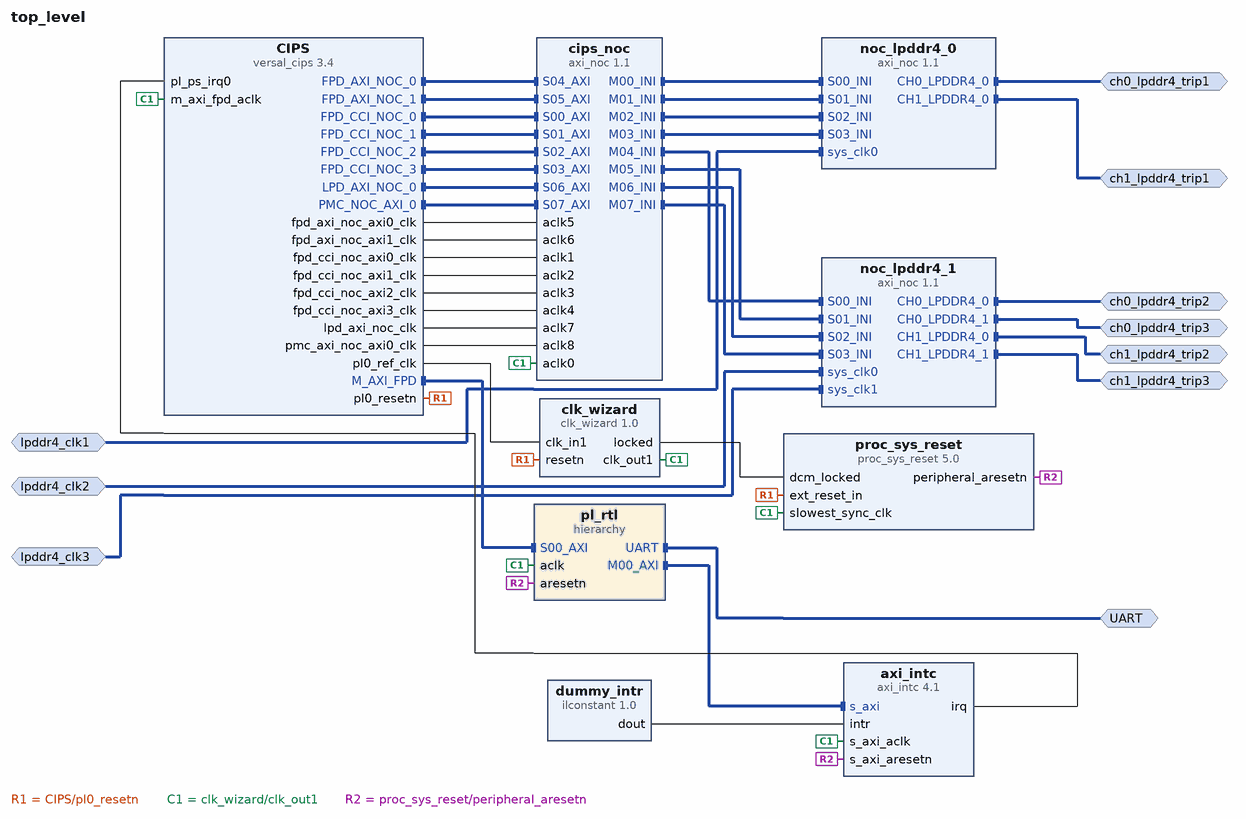
[diagram p0: block diagram of the top level]
# Vivado block design top_level, xcvp1202-vsva2785-2MP-e-S, Vivado 2024.2
create_bd_design top_level

create_bd_intf_port -mode Master -vlnv xilinx.com:interface:lpddr4_rtl:1.0 ch0_lpddr4_trip1
create_bd_intf_port -mode Master -vlnv xilinx.com:interface:lpddr4_rtl:1.0 ch0_lpddr4_trip2
create_bd_intf_port -mode Master -vlnv xilinx.com:interface:lpddr4_rtl:1.0 ch0_lpddr4_trip3
create_bd_intf_port -mode Master -vlnv xilinx.com:interface:lpddr4_rtl:1.0 ch1_lpddr4_trip1
create_bd_intf_port -mode Master -vlnv xilinx.com:interface:lpddr4_rtl:1.0 ch1_lpddr4_trip2
create_bd_intf_port -mode Master -vlnv xilinx.com:interface:lpddr4_rtl:1.0 ch1_lpddr4_trip3
create_bd_intf_port -mode Slave -vlnv xilinx.com:interface:diff_clock_rtl:1.0 lpddr4_clk1
set_property -dict {CONFIG.FREQ_HZ 200321000} [get_bd_intf_ports lpddr4_clk1]
create_bd_intf_port -mode Slave -vlnv xilinx.com:interface:diff_clock_rtl:1.0 lpddr4_clk2
set_property -dict {CONFIG.FREQ_HZ 200321000} [get_bd_intf_ports lpddr4_clk2]
create_bd_intf_port -mode Slave -vlnv xilinx.com:interface:diff_clock_rtl:1.0 lpddr4_clk3
set_property -dict {CONFIG.FREQ_HZ 200321000} [get_bd_intf_ports lpddr4_clk3]
create_bd_intf_port -mode Master -vlnv xilinx.com:interface:uart_rtl:1.0 UART

create_bd_cell -type ip -vlnv xilinx.com:ip:versal_cips:3.4 CIPS
set_property -dict [list \
  CONFIG.CLOCK_MODE Custom \
  CONFIG.DDR_MEMORY_MODE Custom \
  CONFIG.PS_BOARD_INTERFACE ps_pmc_fixed_io \
  CONFIG.PS_PL_CONNECTIVITY_MODE Custom \
  CONFIG.PS_PMC_CONFIG {['CLOCK_MODE Custom', 'DDR_MEMORY_MODE Custom', 'DESIGN_MODE 1', 'DEVICE_INTEGRITY_MODE {Sysmon temperature voltage and external IO monitoring}', 'PMC_CRP_PL0_REF_CTRL_FREQMHZ 99.999992', 'PMC_GPIO0_MIO_PERIPHERAL {{ENABLE 1} {IO {PMC_MIO 0 .. 25}}}', 'PMC_GPIO1_MIO_PERIPHERAL {{ENABLE 1} {IO {PMC_MIO 26 .. 51}}}', 'PMC_MIO37 {{AUX_IO 0} {DIRECTION out} {DRIVE_STRENGTH 8mA} {OUTPUT_DATA high} {PULL pullup} {SCHMITT 0} {SLEW slow} {USAGE GPIO}}', 'PMC_QSPI_FBCLK {{ENABLE 1} {IO {PMC_MIO 6}}}', 'PMC_QSPI_PERIPHERAL_DATA_MODE x4', 'PMC_QSPI_PERIPHERAL_ENABLE 1', 'PMC_QSPI_PERIPHERAL_MODE {Dual Parallel}', 'PMC_REF_CLK_FREQMHZ 33.3333', 'PMC_SD1 {{CD_ENABLE 1} {CD_IO {PMC_MIO 28}} {POW_ENABLE 1} {POW_IO {PMC_MIO 51}} {RESET_ENABLE 0} {RESET_IO {PMC_MIO 12}} {WP_ENABLE 0} {WP_IO {PMC_MIO 1}}}', 'PMC_SD1_PERIPHERAL {{CLK_100_SDR_OTAP_DLY 0x3} {CLK_200_SDR_OTAP_DLY 0x2} {CLK_50_DDR_ITAP_DLY 0x36} {CLK_50_DDR_OTAP_DLY 0x3} {CLK_50_SDR_ITAP_DLY 0x2C} {CLK_50_SDR_OTAP_DLY 0x4} {ENABLE 1} {IO {PMC_MIO 26 .. 36}}}', 'PMC_SD1_SLOT_TYPE {SD 3.0}', 'PMC_USE_PMC_NOC_AXI0 1', 'PS_BOARD_INTERFACE ps_pmc_fixed_io', 'PS_ENET0_MDIO {{ENABLE 1} {IO {PS_MIO 24 .. 25}}}', 'PS_ENET0_PERIPHERAL {{ENABLE 1} {IO {PS_MIO 0 .. 11}}}', 'PS_GEN_IPI0_ENABLE 1', 'PS_GEN_IPI0_MASTER A72', 'PS_GEN_IPI1_ENABLE 1', 'PS_GEN_IPI1_MASTER A72', 'PS_GEN_IPI2_ENABLE 1', 'PS_GEN_IPI2_MASTER A72', 'PS_GEN_IPI3_ENABLE 1', 'PS_GEN_IPI3_MASTER A72', 'PS_GEN_IPI4_ENABLE 1', 'PS_GEN_IPI4_MASTER A72', 'PS_GEN_IPI5_ENABLE 1', 'PS_GEN_IPI5_MASTER A72', 'PS_GEN_IPI6_ENABLE 1', 'PS_GEN_IPI6_MASTER A72', 'PS_I2C0_PERIPHERAL {{ENABLE 1} {IO {PMC_MIO 46 .. 47}}}', 'PS_I2C1_PERIPHERAL {{ENABLE 1} {IO {PMC_MIO 44 .. 45}}}', 'PS_I2CSYSMON_PERIPHERAL {{ENABLE 0} {IO {PMC_MIO 39 .. 40}}}', 'PS_IRQ_USAGE {{CH0 1} {CH1 0} {CH10 0} {CH11 0} {CH12 0} {CH13 0} {CH14 0} {CH15 0} {CH2 0} {CH3 0} {CH4 0} {CH5 0} {CH6 0} {CH7 0} {CH8 0} {CH9 0}}', 'PS_MIO7 {{AUX_IO 0} {DIRECTION in} {DRIVE_STRENGTH 8mA} {OUTPUT_DATA default} {PULL disable} {SCHMITT 0} {SLEW slow} {USAGE Reserved}}', 'PS_MIO9 {{AUX_IO 0} {DIRECTION in} {DRIVE_STRENGTH 8mA} {OUTPUT_DATA default} {PULL disable} {SCHMITT 0} {SLEW slow} {USAGE Reserved}}', 'PS_NUM_FABRIC_RESETS 1', 'PS_PCIE_EP_RESET1_IO {PS_MIO 18}', 'PS_PCIE_EP_RESET2_IO {PS_MIO 19}', 'PS_PCIE_RESET {ENABLE 1}', 'PS_PL_CONNECTIVITY_MODE Custom', 'PS_TTC0_PERIPHERAL_ENABLE 1', 'PS_UART0_PERIPHERAL {{ENABLE 1} {IO {PMC_MIO 42 .. 43}}}', 'PS_USB3_PERIPHERAL {{ENABLE 1} {IO {PMC_MIO 13 .. 25}}}', 'PS_USE_FPD_AXI_NOC0 1', 'PS_USE_FPD_AXI_NOC1 1', 'PS_USE_FPD_CCI_NOC 1', 'PS_USE_M_AXI_FPD 1', 'PS_USE_NOC_LPD_AXI0 1', 'PS_USE_PMCPL_CLK0 1', 'SMON_ALARMS Set_Alarms_On', 'SMON_ENABLE_TEMP_AVERAGING 0', 'SMON_INTERFACE_TO_USE I2C', 'SMON_MEAS36 {{ALARM_ENABLE 1} {ALARM_LOWER 0.00} {ALARM_UPPER 2.00} {AVERAGE_EN 0} {ENABLE 1} {MODE {2 V unipolar}} {NAME VCCAUX} {SUPPLY_NUM 0}}', 'SMON_MEAS37 {{ALARM_ENABLE 1} {ALARM_LOWER 0.00} {ALARM_UPPER 2.00} {AVERAGE_EN 0} {ENABLE 1} {MODE {2 V unipolar}} {NAME VCCAUX_PMC} {SUPPLY_NUM 1}}', 'SMON_MEAS58 {{ALARM_ENABLE 1} {ALARM_LOWER 0.00} {ALARM_UPPER 2.00} {AVERAGE_EN 0} {ENABLE 1} {MODE {2 V unipolar}} {NAME VCC_PMC} {SUPPLY_NUM 2}}', 'SMON_MEAS59 {{ALARM_ENABLE 1} {ALARM_LOWER 0.00} {ALARM_UPPER 2.00} {AVERAGE_EN 0} {ENABLE 1} {MODE {2 V unipolar}} {NAME VCC_PSFP} {SUPPLY_NUM 3}}', 'SMON_MEAS60 {{ALARM_ENABLE 1} {ALARM_LOWER 0.00} {ALARM_UPPER 2.00} {AVERAGE_EN 0} {ENABLE 1} {MODE {2 V unipolar}} {NAME VCC_PSLP} {SUPPLY_NUM 4}}', 'SMON_MEAS62 {{ALARM_ENABLE 1} {ALARM_LOWER 0.00} {ALARM_UPPER 2.00} {AVERAGE_EN 0} {ENABLE 1} {MODE {2 V unipolar}} {NAME VCC_SOC} {SUPPLY_NUM 5}}', 'SMON_MEAS63 {{ALARM_ENABLE 1} {ALARM_LOWER 0.00} {ALARM_UPPER 1.00} {AVERAGE_EN 0} {ENABLE 1} {MODE {2 V unipolar}} {NAME VP_VN} {SUPPLY_NUM 6}}', 'SMON_PMBUS_ADDRESS 0x18', 'SMON_TEMP_AVERAGING_SAMPLES 0']} \
] [get_bd_cells CIPS]
create_bd_cell -type ip -vlnv xilinx.com:ip:axi_intc:4.1 axi_intc
set_property -dict {CONFIG.C_ASYNC_INTR 0xFFFFFFFF CONFIG.C_IRQ_CONNECTION 1} [get_bd_cells axi_intc]
create_bd_cell -type hier pl_rtl
create_bd_cell -type ip -vlnv xilinx.com:ip:axi_noc:1.1 cips_noc
set_property -dict {CONFIG.NUM_CLKS 9 CONFIG.NUM_MI 0 CONFIG.NUM_NMI 8 CONFIG.NUM_NSI 0 CONFIG.NUM_SI 8} [get_bd_cells cips_noc]
create_bd_cell -type ip -vlnv xilinx.com:ip:clk_wizard:1.0 clk_wizard
set_property -dict [list \
  CONFIG.CLKOUT_DRIVES BUFG,BUFG,BUFG,BUFG,BUFG,BUFG,BUFG \
  CONFIG.CLKOUT_DYN_PS None,None,None,None,None,None,None \
  CONFIG.CLKOUT_MATCHED_ROUTING false,false,false,false,false,false,false \
  CONFIG.CLKOUT_PORT clk_out1,clk_out2,clk_out3,clk_out4,clk_out5,clk_out6,clk_out7 \
  CONFIG.CLKOUT_REQUESTED_DUTY_CYCLE 50.000,50.000,50.000,50.000,50.000,50.000,50.000 \
  CONFIG.CLKOUT_REQUESTED_OUT_FREQUENCY 200,150.000,300.000,100.000,100.000,100.000,100.000 \
  CONFIG.CLKOUT_REQUESTED_PHASE 0.000,0.000,0.000,0.000,0.000,0.000,0.000 \
  CONFIG.CLKOUT_USED true,false,false,false,false,false,false \
  CONFIG.JITTER_SEL Min_O_Jitter \
  CONFIG.PRIM_SOURCE No_buffer \
  CONFIG.RESET_TYPE ACTIVE_LOW \
  CONFIG.USE_LOCKED true \
  CONFIG.USE_PHASE_ALIGNMENT true \
  CONFIG.USE_RESET true \
] [get_bd_cells clk_wizard]
create_bd_cell -type ip -vlnv xilinx.com:ip:axi_noc:1.1 noc_lpddr4_0
set_property -dict [list \
  CONFIG.CH0_LPDDR4_0_BOARD_INTERFACE ch0_lpddr4_trip1 \
  CONFIG.CH1_LPDDR4_0_BOARD_INTERFACE ch1_lpddr4_trip1 \
  CONFIG.MC_CHANNEL_INTERLEAVING true \
  CONFIG.MC_CHAN_REGION1 DDR_LOW1 \
  CONFIG.MC_CH_INTERLEAVING_SIZE 4K_Bytes \
  CONFIG.NUM_MCP 4 \
  CONFIG.NUM_MI 0 \
  CONFIG.NUM_NSI 4 \
  CONFIG.NUM_SI 0 \
  CONFIG.sys_clk0_BOARD_INTERFACE lpddr4_clk1 \
] [get_bd_cells noc_lpddr4_0]
create_bd_cell -type ip -vlnv xilinx.com:ip:axi_noc:1.1 noc_lpddr4_1
set_property -dict [list \
  CONFIG.CH0_LPDDR4_0_BOARD_INTERFACE ch0_lpddr4_trip2 \
  CONFIG.CH0_LPDDR4_1_BOARD_INTERFACE ch0_lpddr4_trip3 \
  CONFIG.CH1_LPDDR4_0_BOARD_INTERFACE ch1_lpddr4_trip2 \
  CONFIG.CH1_LPDDR4_1_BOARD_INTERFACE ch1_lpddr4_trip3 \
  CONFIG.MC_CHAN_REGION0 DDR_CH1 \
  CONFIG.NUM_MCP 4 \
  CONFIG.NUM_MI 0 \
  CONFIG.NUM_NSI 4 \
  CONFIG.NUM_SI 0 \
  CONFIG.sys_clk0_BOARD_INTERFACE lpddr4_clk2 \
  CONFIG.sys_clk1_BOARD_INTERFACE lpddr4_clk3 \
] [get_bd_cells noc_lpddr4_1]
create_bd_cell -type ip -vlnv xilinx.com:ip:proc_sys_reset:5.0 proc_sys_reset
create_bd_cell -type inline_hdl -vlnv xilinx.com:inline_hdl:ilconstant:1.0 dummy_intr
set_property -dict {CONFIG.CONST_VAL 0} [get_bd_cells dummy_intr]

# ---- hierarchy /pl_rtl ----
current_bd_instance /pl_rtl
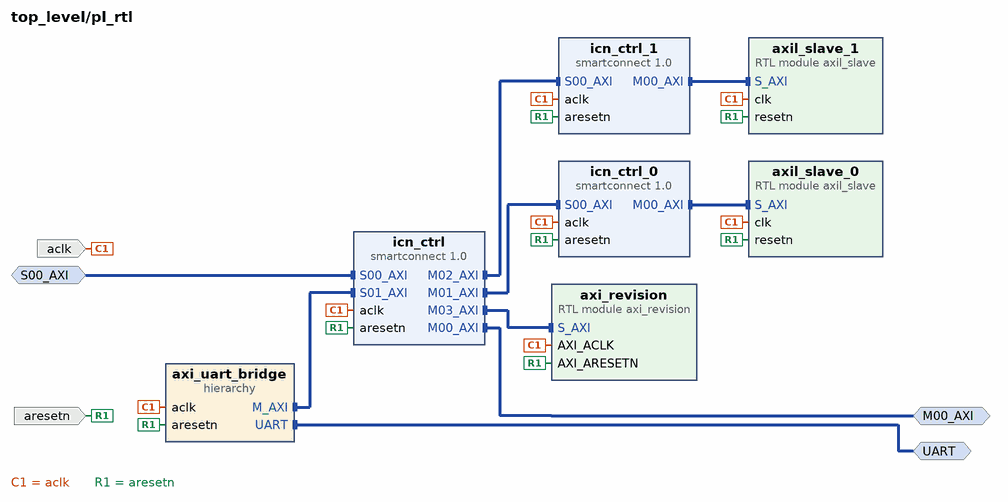
[diagram p1: block diagram inside /pl_rtl]
create_bd_intf_pin -mode Slave -vlnv xilinx.com:interface:aximm_rtl:1.0 S00_AXI
create_bd_intf_pin -mode Master -vlnv xilinx.com:interface:aximm_rtl:1.0 M00_AXI
create_bd_intf_pin -mode Master -vlnv xilinx.com:interface:uart_rtl:1.0 UART
create_bd_pin -dir I -type clk aclk
create_bd_pin -dir I -type rst aresetn

create_bd_cell -type ip -vlnv xilinx.com:ip:smartconnect:1.0 icn_ctrl
set_property -dict {CONFIG.NUM_CLKS 1 CONFIG.NUM_MI 4 CONFIG.NUM_SI 2} [get_bd_cells icn_ctrl]
create_bd_cell -type ip -vlnv xilinx.com:ip:smartconnect:1.0 icn_ctrl_0
set_property -dict {CONFIG.NUM_CLKS 1 CONFIG.NUM_MI 1 CONFIG.NUM_SI 1} [get_bd_cells icn_ctrl_0]
create_bd_cell -type ip -vlnv xilinx.com:ip:smartconnect:1.0 icn_ctrl_1
set_property -dict {CONFIG.NUM_CLKS 1 CONFIG.NUM_MI 1 CONFIG.NUM_SI 1} [get_bd_cells icn_ctrl_1]
create_bd_cell -type module -reference axil_slave axil_slave_0
create_bd_cell -type module -reference axil_slave axil_slave_1
create_bd_cell -type hier axi_uart_bridge
create_bd_cell -type module -reference axi_revision axi_revision

# ---- hierarchy /pl_rtl/axi_uart_bridge ----
current_bd_instance /pl_rtl/axi_uart_bridge
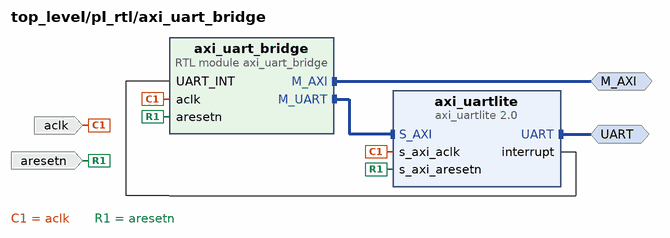
[diagram p2: block diagram inside /pl_rtl/axi_uart_bridge]
create_bd_intf_pin -mode Master -vlnv xilinx.com:interface:uart_rtl:1.0 UART
create_bd_intf_pin -mode Master -vlnv xilinx.com:interface:aximm_rtl:1.0 M_AXI
create_bd_pin -dir I aclk
create_bd_pin -dir I aresetn

create_bd_cell -type module -reference axi_uart_bridge axi_uart_bridge
create_bd_cell -type ip -vlnv xilinx.com:ip:axi_uartlite:2.0 axi_uartlite
set_property -dict {CONFIG.C_BAUDRATE 115200} [get_bd_cells axi_uartlite]

# ---- connections ----

current_bd_instance /pl_rtl
connect_bd_intf_net -intf_net CIPS_0_M_AXI_GP0 [get_bd_intf_pins S00_AXI] [get_bd_intf_pins icn_ctrl/S00_AXI]
connect_bd_intf_net [get_bd_intf_pins axi_uart_bridge/M_AXI] [get_bd_intf_pins icn_ctrl/S01_AXI]
connect_bd_intf_net [get_bd_intf_pins UART] [get_bd_intf_pins axi_uart_bridge/UART]
connect_bd_intf_net [get_bd_intf_pins axil_slave_0/S_AXI] [get_bd_intf_pins icn_ctrl_0/M00_AXI]
connect_bd_intf_net [get_bd_intf_pins axil_slave_1/S_AXI] [get_bd_intf_pins icn_ctrl_1/M00_AXI]
connect_bd_intf_net [get_bd_intf_pins M00_AXI] [get_bd_intf_pins icn_ctrl/M00_AXI]
connect_bd_intf_net [get_bd_intf_pins icn_ctrl/M01_AXI] [get_bd_intf_pins icn_ctrl_0/S00_AXI]
connect_bd_intf_net [get_bd_intf_pins icn_ctrl/M02_AXI] [get_bd_intf_pins icn_ctrl_1/S00_AXI]
connect_bd_intf_net [get_bd_intf_pins axi_revision/S_AXI] [get_bd_intf_pins icn_ctrl/M03_AXI]
connect_bd_net -net clk_wizard_0_clk_out1 [get_bd_pins aclk] \
  [get_bd_pins icn_ctrl/aclk] [get_bd_pins icn_ctrl_0/aclk] [get_bd_pins icn_ctrl_1/aclk] [get_bd_pins axil_slave_1/clk] \
  [get_bd_pins axil_slave_0/clk] [get_bd_pins axi_uart_bridge/aclk] [get_bd_pins axi_revision/AXI_ACLK]
connect_bd_net -net proc_sys_reset_0_peripheral_aresetn [get_bd_pins aresetn] \
  [get_bd_pins icn_ctrl_0/aresetn] [get_bd_pins icn_ctrl_1/aresetn] [get_bd_pins icn_ctrl/aresetn] \
  [get_bd_pins axil_slave_1/resetn] [get_bd_pins axil_slave_0/resetn] [get_bd_pins axi_uart_bridge/aresetn] \
  [get_bd_pins axi_revision/AXI_ARESETN]
set_property PFM.AXI_PORT {M04_AXI { memport "M_AXI_GP" sptag "" memory "" } } [get_bd_cells icn_ctrl]
set_property PFM.AXI_PORT {M01_AXI {memport "M_AXI_GP" sptag "" memory ""} M02_AXI {memport "M_AXI_GP" sptag "" memory ""} M03_AXI {memport "M_AXI_GP" sptag "" memory ""} M04_AXI {memport "M_AXI_GP" sptag "" memory ""} M05_AXI {memport "M_AXI_GP" sptag "" memory ""} M06_AXI {memport "M_AXI_GP" sptag "" memory ""} M07_AXI {memport "M_AXI_GP" sptag "" memory ""} M08_AXI {memport "M_AXI_GP" sptag "" memory ""} M09_AXI {memport "M_AXI_GP" sptag "" memory ""} M10_AXI {memport "M_AXI_GP" sptag "" memory ""} M11_AXI {memport "M_AXI_GP" sptag "" memory ""} M12_AXI {memport "M_AXI_GP" sptag "" memory ""} M13_AXI {memport "M_AXI_GP" sptag "" memory ""} M14_AXI {memport "M_AXI_GP" sptag "" memory ""} M15_AXI {memport "M_AXI_GP" sptag "" memory ""}} [get_bd_cells icn_ctrl_0]
set_property PFM.AXI_PORT {M01_AXI {memport "M_AXI_GP" sptag "" memory ""} M02_AXI {memport "M_AXI_GP" sptag "" memory ""} M03_AXI {memport "M_AXI_GP" sptag "" memory ""} M04_AXI {memport "M_AXI_GP" sptag "" memory ""} M05_AXI {memport "M_AXI_GP" sptag "" memory ""} M06_AXI {memport "M_AXI_GP" sptag "" memory ""} M07_AXI {memport "M_AXI_GP" sptag "" memory ""} M08_AXI {memport "M_AXI_GP" sptag "" memory ""} M09_AXI {memport "M_AXI_GP" sptag "" memory ""} M10_AXI {memport "M_AXI_GP" sptag "" memory ""} M11_AXI {memport "M_AXI_GP" sptag "" memory ""} M12_AXI {memport "M_AXI_GP" sptag "" memory ""} M13_AXI {memport "M_AXI_GP" sptag "" memory ""} M14_AXI {memport "M_AXI_GP" sptag "" memory ""} M15_AXI {memport "M_AXI_GP" sptag "" memory ""}} [get_bd_cells icn_ctrl_1]

current_bd_instance /pl_rtl/axi_uart_bridge
connect_bd_intf_net [get_bd_intf_pins M_AXI] [get_bd_intf_pins axi_uart_bridge/M_AXI]
connect_bd_intf_net [get_bd_intf_pins axi_uartlite/S_AXI] [get_bd_intf_pins axi_uart_bridge/M_UART]
connect_bd_intf_net -intf_net axi_uartlite_0_UART [get_bd_intf_pins UART] [get_bd_intf_pins axi_uartlite/UART]
connect_bd_net [get_bd_pins aclk] [get_bd_pins axi_uart_bridge/aclk] [get_bd_pins axi_uartlite/s_axi_aclk]
connect_bd_net [get_bd_pins aresetn] [get_bd_pins axi_uart_bridge/aresetn] [get_bd_pins axi_uartlite/s_axi_aresetn]
connect_bd_net [get_bd_pins axi_uartlite/interrupt] [get_bd_pins axi_uart_bridge/UART_INT]

current_bd_instance /
connect_bd_intf_net -intf_net CIPS_0_FPD_AXI_NOC_0 [get_bd_intf_pins CIPS/FPD_AXI_NOC_0] [get_bd_intf_pins cips_noc/S04_AXI]
connect_bd_intf_net -intf_net CIPS_0_FPD_AXI_NOC_1 [get_bd_intf_pins CIPS/FPD_AXI_NOC_1] [get_bd_intf_pins cips_noc/S05_AXI]
connect_bd_intf_net -intf_net CIPS_0_FPD_CCI_NOC_0 [get_bd_intf_pins CIPS/FPD_CCI_NOC_0] [get_bd_intf_pins cips_noc/S00_AXI]
connect_bd_intf_net -intf_net CIPS_0_FPD_CCI_NOC_1 [get_bd_intf_pins CIPS/FPD_CCI_NOC_1] [get_bd_intf_pins cips_noc/S01_AXI]
connect_bd_intf_net -intf_net CIPS_0_FPD_CCI_NOC_2 [get_bd_intf_pins CIPS/FPD_CCI_NOC_2] [get_bd_intf_pins cips_noc/S02_AXI]
connect_bd_intf_net -intf_net CIPS_0_FPD_CCI_NOC_3 [get_bd_intf_pins CIPS/FPD_CCI_NOC_3] [get_bd_intf_pins cips_noc/S03_AXI]
connect_bd_intf_net -intf_net CIPS_0_LPD_AXI_NOC_0 [get_bd_intf_pins CIPS/LPD_AXI_NOC_0] [get_bd_intf_pins cips_noc/S06_AXI]
connect_bd_intf_net -intf_net CIPS_0_M_AXI_GP0 [get_bd_intf_pins CIPS/M_AXI_FPD] [get_bd_intf_pins pl_rtl/S00_AXI]
connect_bd_intf_net -intf_net CIPS_0_PMC_NOC_AXI_0 [get_bd_intf_pins CIPS/PMC_NOC_AXI_0] [get_bd_intf_pins cips_noc/S07_AXI]
connect_bd_intf_net [get_bd_intf_pins cips_noc/M00_INI] [get_bd_intf_pins noc_lpddr4_0/S00_INI]
connect_bd_intf_net [get_bd_intf_pins cips_noc/M01_INI] [get_bd_intf_pins noc_lpddr4_0/S01_INI]
connect_bd_intf_net [get_bd_intf_pins cips_noc/M02_INI] [get_bd_intf_pins noc_lpddr4_0/S02_INI]
connect_bd_intf_net [get_bd_intf_pins cips_noc/M03_INI] [get_bd_intf_pins noc_lpddr4_0/S03_INI]
connect_bd_intf_net [get_bd_intf_pins cips_noc/M04_INI] [get_bd_intf_pins noc_lpddr4_1/S00_INI]
connect_bd_intf_net [get_bd_intf_pins cips_noc/M05_INI] [get_bd_intf_pins noc_lpddr4_1/S01_INI]
connect_bd_intf_net [get_bd_intf_pins cips_noc/M06_INI] [get_bd_intf_pins noc_lpddr4_1/S02_INI]
connect_bd_intf_net [get_bd_intf_pins cips_noc/M07_INI] [get_bd_intf_pins noc_lpddr4_1/S03_INI]
connect_bd_intf_net -intf_net icn_ctrl_M00_AXI [get_bd_intf_pins axi_intc/s_axi] [get_bd_intf_pins pl_rtl/M00_AXI]
connect_bd_intf_net -intf_net lpddr4_clk1_1 [get_bd_intf_ports lpddr4_clk1] [get_bd_intf_pins noc_lpddr4_0/sys_clk0]
connect_bd_intf_net -intf_net lpddr4_clk2_1 [get_bd_intf_ports lpddr4_clk2] [get_bd_intf_pins noc_lpddr4_1/sys_clk0]
connect_bd_intf_net -intf_net lpddr4_clk3_1 [get_bd_intf_ports lpddr4_clk3] [get_bd_intf_pins noc_lpddr4_1/sys_clk1]
connect_bd_intf_net [get_bd_intf_ports ch0_lpddr4_trip1] [get_bd_intf_pins noc_lpddr4_0/CH0_LPDDR4_0]
connect_bd_intf_net [get_bd_intf_ports ch1_lpddr4_trip1] [get_bd_intf_pins noc_lpddr4_0/CH1_LPDDR4_0]
connect_bd_intf_net [get_bd_intf_ports ch0_lpddr4_trip2] [get_bd_intf_pins noc_lpddr4_1/CH0_LPDDR4_0]
connect_bd_intf_net [get_bd_intf_ports ch0_lpddr4_trip3] [get_bd_intf_pins noc_lpddr4_1/CH0_LPDDR4_1]
connect_bd_intf_net [get_bd_intf_ports ch1_lpddr4_trip2] [get_bd_intf_pins noc_lpddr4_1/CH1_LPDDR4_0]
connect_bd_intf_net [get_bd_intf_ports ch1_lpddr4_trip3] [get_bd_intf_pins noc_lpddr4_1/CH1_LPDDR4_1]
connect_bd_intf_net [get_bd_intf_pins pl_rtl/UART] [get_bd_intf_ports UART]
connect_bd_net -net CIPS_0_fpd_axi_noc_axi0_clk [get_bd_pins CIPS/fpd_axi_noc_axi0_clk] [get_bd_pins cips_noc/aclk5]
connect_bd_net -net CIPS_0_fpd_axi_noc_axi1_clk [get_bd_pins CIPS/fpd_axi_noc_axi1_clk] [get_bd_pins cips_noc/aclk6]
connect_bd_net -net CIPS_0_fpd_cci_noc_axi0_clk [get_bd_pins CIPS/fpd_cci_noc_axi0_clk] [get_bd_pins cips_noc/aclk1]
connect_bd_net -net CIPS_0_fpd_cci_noc_axi1_clk [get_bd_pins CIPS/fpd_cci_noc_axi1_clk] [get_bd_pins cips_noc/aclk2]
connect_bd_net -net CIPS_0_fpd_cci_noc_axi2_clk [get_bd_pins CIPS/fpd_cci_noc_axi2_clk] [get_bd_pins cips_noc/aclk3]
connect_bd_net -net CIPS_0_fpd_cci_noc_axi3_clk [get_bd_pins CIPS/fpd_cci_noc_axi3_clk] [get_bd_pins cips_noc/aclk4]
connect_bd_net -net CIPS_0_lpd_axi_noc_clk [get_bd_pins CIPS/lpd_axi_noc_clk] [get_bd_pins cips_noc/aclk7]
connect_bd_net -net CIPS_0_pl_clk0 [get_bd_pins CIPS/pl0_ref_clk] [get_bd_pins clk_wizard/clk_in1]
connect_bd_net -net CIPS_0_pl_resetn1 [get_bd_pins CIPS/pl0_resetn] [get_bd_pins clk_wizard/resetn] [get_bd_pins proc_sys_reset/ext_reset_in]
connect_bd_net -net CIPS_0_pmc_axi_noc_axi0_clk [get_bd_pins CIPS/pmc_axi_noc_axi0_clk] [get_bd_pins cips_noc/aclk8]
connect_bd_net -net axi_intc_0_irq [get_bd_pins axi_intc/irq] [get_bd_pins CIPS/pl_ps_irq0]
connect_bd_net -net clk_wizard_0_clk_out1 [get_bd_pins clk_wizard/clk_out1] \
  [get_bd_pins CIPS/m_axi_fpd_aclk] [get_bd_pins cips_noc/aclk0] [get_bd_pins proc_sys_reset/slowest_sync_clk] \
  [get_bd_pins axi_intc/s_axi_aclk] [get_bd_pins pl_rtl/aclk]
connect_bd_net -net clk_wizard_0_locked [get_bd_pins clk_wizard/locked] [get_bd_pins proc_sys_reset/dcm_locked]
connect_bd_net [get_bd_pins dummy_intr/dout] [get_bd_pins axi_intc/intr]
connect_bd_net -net proc_sys_reset_0_peripheral_aresetn [get_bd_pins proc_sys_reset/peripheral_aresetn] \
  [get_bd_pins axi_intc/s_axi_aresetn] [get_bd_pins pl_rtl/aresetn]
set_property PFM.CLOCK {clk_out1 {id "0" is_default "true" proc_sys_reset "/proc_sys_reset" status "fixed"}} [get_bd_cells clk_wizard]
set_property PFM.AXI_PORT {S00_AXI {memport "S_AXI_NOC" sptag "DDR"} S01_AXI {memport "S_AXI_NOC" sptag "DDR"} S02_AXI {memport "S_AXI_NOC" sptag "DDR"} S03_AXI {memport "S_AXI_NOC" sptag "DDR"} S04_AXI {memport "S_AXI_NOC" sptag "DDR"} S05_AXI {memport "S_AXI_NOC" sptag "DDR"} S06_AXI {memport "S_AXI_NOC" sptag "DDR"} S07_AXI {memport "S_AXI_NOC" sptag "DDR"} S08_AXI {memport "S_AXI_NOC" sptag "DDR"} S09_AXI {memport "S_AXI_NOC" sptag "DDR"} S10_AXI {memport "S_AXI_NOC" sptag "DDR"} S11_AXI {memport "S_AXI_NOC" sptag "DDR"} S12_AXI {memport "S_AXI_NOC" sptag "DDR"} S13_AXI {memport "S_AXI_NOC" sptag "DDR"} S14_AXI {memport "S_AXI_NOC" sptag "DDR"} S15_AXI {memport "S_AXI_NOC" sptag "DDR"} S16_AXI {memport "S_AXI_NOC" sptag "DDR"} S17_AXI {memport "S_AXI_NOC" sptag "DDR"} S18_AXI {memport "S_AXI_NOC" sptag "DDR"} S19_AXI {memport "S_AXI_NOC" sptag "DDR"} S20_AXI {memport "S_AXI_NOC" sptag "DDR"} S21_AXI {memport "S_AXI_NOC" sptag "DDR"} S22_AXI {memport "S_AXI_NOC" sptag "DDR"} S23_AXI {memport "S_AXI_NOC" sptag "DDR"} S24_AXI {memport "S_AXI_NOC" sptag "DDR"} S25_AXI {memport "S_AXI_NOC" sptag "DDR"} S26_AXI {memport "S_AXI_NOC" sptag "DDR"} S27_AXI {memport "S_AXI_NOC" sptag "DDR"}} [get_bd_cells noc_lpddr4_0]
set_property PFM.AXI_PORT {S00_AXI {memport "S_AXI_NOC" sptag "LPDDR"} S01_AXI {memport "S_AXI_NOC" sptag "LPDDR"} S02_AXI {memport "S_AXI_NOC" sptag "LPDDR"} S03_AXI {memport "S_AXI_NOC" sptag "LPDDR"} S04_AXI {memport "S_AXI_NOC" sptag "LPDDR"} S05_AXI {memport "S_AXI_NOC" sptag "LPDDR"} S06_AXI {memport "S_AXI_NOC" sptag "LPDDR"} S07_AXI {memport "S_AXI_NOC" sptag "LPDDR"} S08_AXI {memport "S_AXI_NOC" sptag "LPDDR"} S09_AXI {memport "S_AXI_NOC" sptag "LPDDR"} S10_AXI {memport "S_AXI_NOC" sptag "LPDDR"} S11_AXI {memport "S_AXI_NOC" sptag "LPDDR"} S12_AXI {memport "S_AXI_NOC" sptag "LPDDR"} S13_AXI {memport "S_AXI_NOC" sptag "LPDDR"} S14_AXI {memport "S_AXI_NOC" sptag "LPDDR"} S15_AXI {memport "S_AXI_NOC" sptag "LPDDR"} S16_AXI {memport "S_AXI_NOC" sptag "LPDDR"} S17_AXI {memport "S_AXI_NOC" sptag "LPDDR"} S18_AXI {memport "S_AXI_NOC" sptag "LPDDR"} S19_AXI {memport "S_AXI_NOC" sptag "LPDDR"} S20_AXI {memport "S_AXI_NOC" sptag "LPDDR"} S21_AXI {memport "S_AXI_NOC" sptag "LPDDR"} S22_AXI {memport "S_AXI_NOC" sptag "LPDDR"} S23_AXI {memport "S_AXI_NOC" sptag "LPDDR"} S24_AXI {memport "S_AXI_NOC" sptag "LPDDR"} S25_AXI {memport "S_AXI_NOC" sptag "LPDDR"} S26_AXI {memport "S_AXI_NOC" sptag "LPDDR"} S27_AXI {memport "S_AXI_NOC" sptag "LPDDR"}} [get_bd_cells noc_lpddr4_1]

# ---- address map ----
assign_bd_address -offset 0x0000000000000000 -range 2G -target_address_space [get_bd_addr_spaces CIPS/FPD_AXI_NOC_0] [get_bd_addr_segs noc_lpddr4_0/S00_INI/C0_DDR_LOW0]
assign_bd_address -offset 0x0000000800000000 -range 2G -target_address_space [get_bd_addr_spaces CIPS/FPD_AXI_NOC_0] [get_bd_addr_segs noc_lpddr4_0/S00_INI/C0_DDR_LOW1]
assign_bd_address -offset 0x0000000000000000 -range 2G -target_address_space [get_bd_addr_spaces CIPS/FPD_AXI_NOC_1] [get_bd_addr_segs noc_lpddr4_0/S00_INI/C0_DDR_LOW0]
assign_bd_address -offset 0x0000000800000000 -range 2G -target_address_space [get_bd_addr_spaces CIPS/FPD_AXI_NOC_1] [get_bd_addr_segs noc_lpddr4_0/S00_INI/C0_DDR_LOW1]
assign_bd_address -offset 0x0000000000000000 -range 2G -target_address_space [get_bd_addr_spaces CIPS/FPD_CCI_NOC_0] [get_bd_addr_segs noc_lpddr4_0/S00_INI/C0_DDR_LOW0]
assign_bd_address -offset 0x0000000800000000 -range 2G -target_address_space [get_bd_addr_spaces CIPS/FPD_CCI_NOC_0] [get_bd_addr_segs noc_lpddr4_0/S00_INI/C0_DDR_LOW1]
assign_bd_address -offset 0x0000050000000000 -range 8G -target_address_space [get_bd_addr_spaces CIPS/FPD_CCI_NOC_0] [get_bd_addr_segs noc_lpddr4_1/S00_INI/C0_DDR_CH1x2]
assign_bd_address -offset 0x0000000000000000 -range 2G -target_address_space [get_bd_addr_spaces CIPS/FPD_CCI_NOC_1] [get_bd_addr_segs noc_lpddr4_0/S01_INI/C1_DDR_LOW0]
assign_bd_address -offset 0x0000000800000000 -range 2G -target_address_space [get_bd_addr_spaces CIPS/FPD_CCI_NOC_1] [get_bd_addr_segs noc_lpddr4_0/S01_INI/C1_DDR_LOW1]
assign_bd_address -offset 0x0000050000000000 -range 8G -target_address_space [get_bd_addr_spaces CIPS/FPD_CCI_NOC_1] [get_bd_addr_segs noc_lpddr4_1/S01_INI/C1_DDR_CH1x2]
assign_bd_address -offset 0x0000000000000000 -range 2G -target_address_space [get_bd_addr_spaces CIPS/FPD_CCI_NOC_2] [get_bd_addr_segs noc_lpddr4_0/S02_INI/C2_DDR_LOW0]
assign_bd_address -offset 0x0000000800000000 -range 2G -target_address_space [get_bd_addr_spaces CIPS/FPD_CCI_NOC_2] [get_bd_addr_segs noc_lpddr4_0/S02_INI/C2_DDR_LOW1]
assign_bd_address -offset 0x0000050000000000 -range 8G -target_address_space [get_bd_addr_spaces CIPS/FPD_CCI_NOC_2] [get_bd_addr_segs noc_lpddr4_1/S02_INI/C2_DDR_CH1x2]
assign_bd_address -offset 0x0000000000000000 -range 2G -target_address_space [get_bd_addr_spaces CIPS/FPD_CCI_NOC_3] [get_bd_addr_segs noc_lpddr4_0/S03_INI/C3_DDR_LOW0]
assign_bd_address -offset 0x0000000800000000 -range 2G -target_address_space [get_bd_addr_spaces CIPS/FPD_CCI_NOC_3] [get_bd_addr_segs noc_lpddr4_0/S03_INI/C3_DDR_LOW1]
assign_bd_address -offset 0x0000050000000000 -range 8G -target_address_space [get_bd_addr_spaces CIPS/FPD_CCI_NOC_3] [get_bd_addr_segs noc_lpddr4_1/S03_INI/C3_DDR_CH1x2]
assign_bd_address -offset 0x0000000000000000 -range 2G -target_address_space [get_bd_addr_spaces CIPS/LPD_AXI_NOC_0] [get_bd_addr_segs noc_lpddr4_0/S00_INI/C0_DDR_LOW0]
assign_bd_address -offset 0x0000000800000000 -range 2G -target_address_space [get_bd_addr_spaces CIPS/LPD_AXI_NOC_0] [get_bd_addr_segs noc_lpddr4_0/S00_INI/C0_DDR_LOW1]
assign_bd_address -offset 0x000A4000000 -range 4K -target_address_space [get_bd_addr_spaces CIPS/M_AXI_FPD] [get_bd_addr_segs pl_rtl/axi_revision/S_AXI/reg0]
assign_bd_address -offset 0x000A4002000 -range 4K -target_address_space [get_bd_addr_spaces CIPS/M_AXI_FPD] [get_bd_addr_segs pl_rtl/axil_slave_0/S_AXI/reg0]
assign_bd_address -offset 0x000A4003000 -range 4K -target_address_space [get_bd_addr_spaces CIPS/M_AXI_FPD] [get_bd_addr_segs pl_rtl/axil_slave_1/S_AXI/reg0]
assign_bd_address -offset 0x000A4020000 -range 64K -target_address_space [get_bd_addr_spaces CIPS/M_AXI_FPD] [get_bd_addr_segs axi_intc/S_AXI/Reg]
assign_bd_address -offset 0x0000000000000000 -range 2G -target_address_space [get_bd_addr_spaces CIPS/PMC_NOC_AXI_0] [get_bd_addr_segs noc_lpddr4_0/S00_INI/C0_DDR_LOW0]
assign_bd_address -offset 0x0000000800000000 -range 2G -target_address_space [get_bd_addr_spaces CIPS/PMC_NOC_AXI_0] [get_bd_addr_segs noc_lpddr4_0/S00_INI/C0_DDR_LOW1]
assign_bd_address -offset 0x0000050000000000 -range 8G -target_address_space [get_bd_addr_spaces CIPS/PMC_NOC_AXI_0] [get_bd_addr_segs noc_lpddr4_1/S00_INI/C0_DDR_CH1x2]
assign_bd_address -offset 0x00000000A4000000 -range 4K -target_address_space [get_bd_addr_spaces pl_rtl/axi_uart_bridge/axi_uart_bridge/M_AXI] [get_bd_addr_segs pl_rtl/axi_revision/S_AXI/reg0]
assign_bd_address -offset 0x00000000A4001000 -range 4K -target_address_space [get_bd_addr_spaces pl_rtl/axi_uart_bridge/axi_uart_bridge/M_AXI] [get_bd_addr_segs pl_rtl/axil_slave_0/S_AXI/reg0]
assign_bd_address -offset 0x00000000A4002000 -range 4K -target_address_space [get_bd_addr_spaces pl_rtl/axi_uart_bridge/axi_uart_bridge/M_AXI] [get_bd_addr_segs pl_rtl/axil_slave_1/S_AXI/reg0]
assign_bd_address -offset 0x00000000A4020000 -range 64K -target_address_space [get_bd_addr_spaces pl_rtl/axi_uart_bridge/axi_uart_bridge/M_AXI] [get_bd_addr_segs axi_intc/S_AXI/Reg]
assign_bd_address -offset 0x40600000 -range 64K -target_address_space [get_bd_addr_spaces pl_rtl/axi_uart_bridge/axi_uart_bridge/M_UART] [get_bd_addr_segs pl_rtl/axi_uart_bridge/axi_uartlite/S_AXI/Reg]

validate_bd_design
save_bd_design
